# Altium schematic sheet Sheet1.SchDoc
size A; SheetNumber: 1; SheetTotal: 1
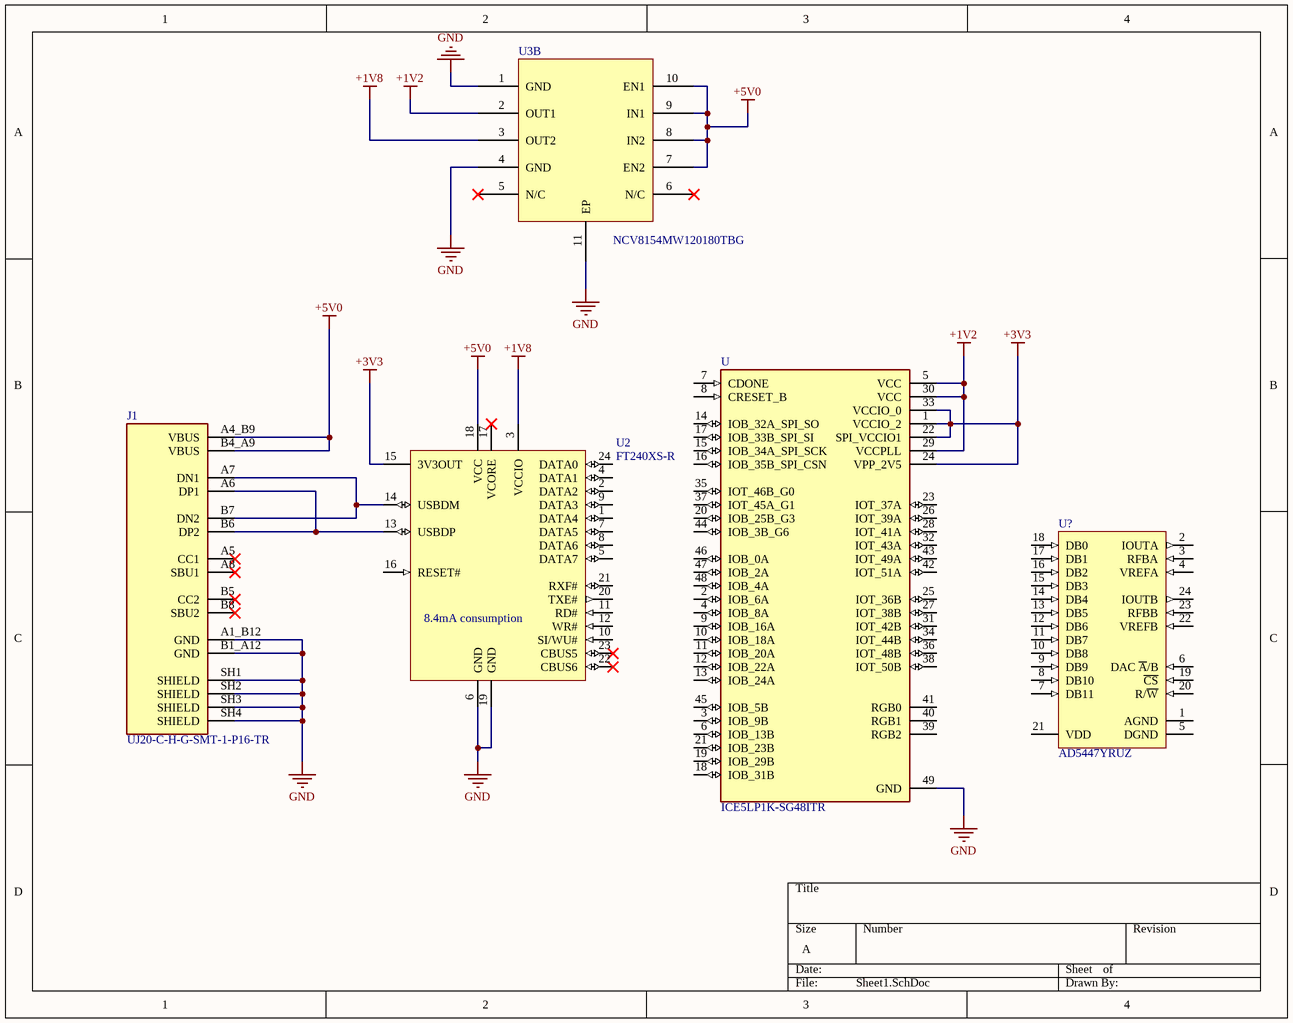
[diagram p0: Sheet1.SchDoc]

## Parts
J1  UJ20-C-H-G-SMT-1-P16-TR  [SAMESKY_UJ20-C-H-G-SMT-1-P16-TR]
U  ICE5LP1K-SG48ITR  [QFN50P700X700X100-49N]
U2  FT240XS-R  [SSOP-24_N]
U3  NCV8154MW120180TBG  [SON50P300X300X100-11N]  (part B of 2)
U?  AD5447YRUZ  [RU-24_M]

## Nets
+1V2: U.5(VCC) U.29(VCCPLL) U.30(VCC) U3.2(OUT1)
+1V8: U2.3(VCCIO) U3.3(OUT2)
+3V3: U.1(VCCIO_2) U.22(SPI_VCCIO1) U.24(VPP_2V5) U.33(VCCIO_0) U2.15(3V3OUT)
+5V0: J1.A4_B9(VBUS) J1.B4_A9(VBUS) U2.18(VCC) U3.7(EN2) U3.8(IN2) U3.9(IN1) U3.10(EN1)
GND: J1.A1_B12(GND) J1.B1_A12(GND) J1.SH1(SHIELD) J1.SH2(SHIELD) J1.SH3(SHIELD) J1.SH4(SHIELD) U.49(GND) U2.6(GND) U2.19(GND) U3.1(GND) U3.4(GND) U3.11(EP)
NetJ1_A6: J1.A6(DP1) J1.B6(DP2) U2.13(USBDP)
NetJ1_A7: J1.A7(DN1) J1.B7(DN2) U2.14(USBDM)

Not connected (* = marked no-connect by the designer): J1 A5(CC1)* A8(SBU1)* B5(CC2)* B8(SBU2)*; U 2(IOB_6A) 3(IOB_9B) 4(IOB_8A) 6(IOB_13B) 7(CDONE) 8(CRESET_B) 9(IOB_16A) 10(IOB_18A) 11(IOB_20A) 12(IOB_22A) 13(IOB_24A) 14(IOB_32A_SPI_SO) 15(IOB_34A_SPI_SCK) 16(IOB_35B_SPI_CSN) 17(IOB_33B_SPI_SI) 18(IOB_31B) 19(IOB_29B) 20(IOB_25B_G3) 21(IOB_23B) 23(IOT_37A) 25(IOT_36B) 26(IOT_39A) 27(IOT_38B) 28(IOT_41A) 31(IOT_42B) 32(IOT_43A) 34(IOT_44B) 35(IOT_46B_G0) 36(IOT_48B) 37(IOT_45A_G1) 38(IOT_50B) 39(RGB2) 40(RGB1) 41(RGB0) 42(IOT_51A) 43(IOT_49A) 44(IOB_3B_G6) 45(IOB_5B) 46(IOB_0A) 47(IOB_2A) 48(IOB_4A); U2 1(DATA4) 2(DATA2) 4(DATA1) 5(DATA7) 7(DATA5) 8(DATA6) 9(DATA3) 10(SI/WU#) 11(RD#) 12(WR#) 16(RESET#) 17(VCORE)* 20(TXE#) 21(RXF#) 22(CBUS6)* 23(CBUS5)* 24(DATA0); U3 5(N/C)* 6(N/C)*; U? 1(AGND) 2(IOUTA) 3(RFBA) 4(VREFA) 5(DGND) 6(DAC_~{A}/B) 7(DB11) 8(DB10) 9(DB9) 10(DB8) 11(DB7) 12(DB6) 13(DB5) 14(DB4) 15(DB3) 16(DB2) 17(DB1) 18(DB0) 19(~{CS}) 20(R/~{W}) 21(VDD) 22(VREFB) 23(RFBB) 24(IOUTB)

## Notes on the sheet
- (near U2) 8.4mA consumption

## Library data of the parts
J1 = UJ20-C-H-G-SMT-1-P16-TR: USB-C (USB TYPE-C) USB 2.0 Receptacle Connector 24 (16+8 Dummy) Position Surface Mount, Right Angle; Through Hole; MF: Same Sky; SnapEDA_Link: https://www.snapeda.com/parts/UJ20-C-H-G-SMT-1-P16-TR/Same+Sky/view-part/?ref=snap; Package: None; Value: *; MP: UJ20-C-H-G-SMT-1-P16-TR; Check_prices: https://www.snapeda.com/parts/UJ20-C-H-G-SMT-1-P16-TR/Same+Sky/view-part/?ref=eda
U = ICE5LP1K-SG48ITR: IC FPGA 39 I/O 48QFN; MF: Lattice Semiconductor; Availability: Unavailable; Price: None; Package: QFN-48 Lattice Semiconductor; Value: *; SnapEDA_Link: https://www.snapeda.com/parts/ICE5LP1K-SG48ITR/Lattice%20Semiconductor%20Corporation/view-part/1219517/?ref=snap; MP: ICE5LP1K-SG48ITR
U2 = CMP-0248-00018-2: USB to Parallel FIFO Interface Chip, UHCI/OHCI/EHCI Compatible, USB 2.0 Compatible, -40 to +85 degC, 24-Pin SSOP, Pb-Free, Tape and Reel; Manufacturer: FTDI; PackageVersion: Feb-13; PackageDescription: 24-Pin Shrink Small Outline Package, 0.025" Lead Pitch, 150mil Wide Body; DatasheetVersion: ver 1.3, Feb-2013; ComponentLink1Description: Manufacturer URL; ComponentLink1URL: http://www.ftdichip.com/; ComponentLink2Description: Datasheet; ComponentLink3URL: www.ftdichip.com/Products/ICs/FT240X.html; ComponentLink2URL: http://www.ftdichip.com/Support/Documents/DataSheets/ICs/DS_FT240X.pdf; RevisionNote: DatasheetVersion updated to 1.3 Feb-2013; Code_JEDEC: MO-137-AE; ComponentLink3Description: FT240X Product Page; PackageReference: SSOP-24; PartNumber: FT240XS-R
U? = CMP-0318-01635-2: Dual 12-Bit High Bandwidth Multiplying Digital-to-Analog Converter, RU-24, Pb-Free, Tube; Generic Part Number: AD5447; Manufacturer: Analog Devices; # DAC Outputs: 2; Op Pwr Diss: 3.3ÂµW; Resolution (Bits): 12; Single Supply: Yes; Max V+: 5.5V; Settling Time: 80ns; PackageVersion: 2002; ComponentLink3URL: http://www.analog.com/static/imported-files/packages/380523655245964505593671154107510036154RU24.pdf; RoHS: Y; ComponentLink4URL: http://www.analog.com/en/digital-to-analog-converters/da-converters/ad5447/products/product.html; ComponentLink1URL: http://www.analog.com/en/index.html; ComponentLink2Description: Datasheet; Mounting Technology: Surface Mount; Packing: Tube; Code_JEDEC: MO-153-AD; ComponentLink2URL: http://www.analog.com/static/imported-files/data_sheets/AD5428_5440_5447.pdf; DatasheetVersion: Rev.C; RevisionNote: Component URL fixed; PackageReference: RU-24; PartNumber: AD5447YRUZ; PackageDescription: 24-Lead Thin Shrink Small Outline Package [TSSOP]; ComponentLink4Description: Product URL; ComponentLink1Description: Manufacturer URL; ComponentLink3Description: Package Specification